# Altium schematic sheet MCU_stm32f407vet6.SchDoc
size 381 x 241 mm; SheetNumber: 1; SheetTotal: 5
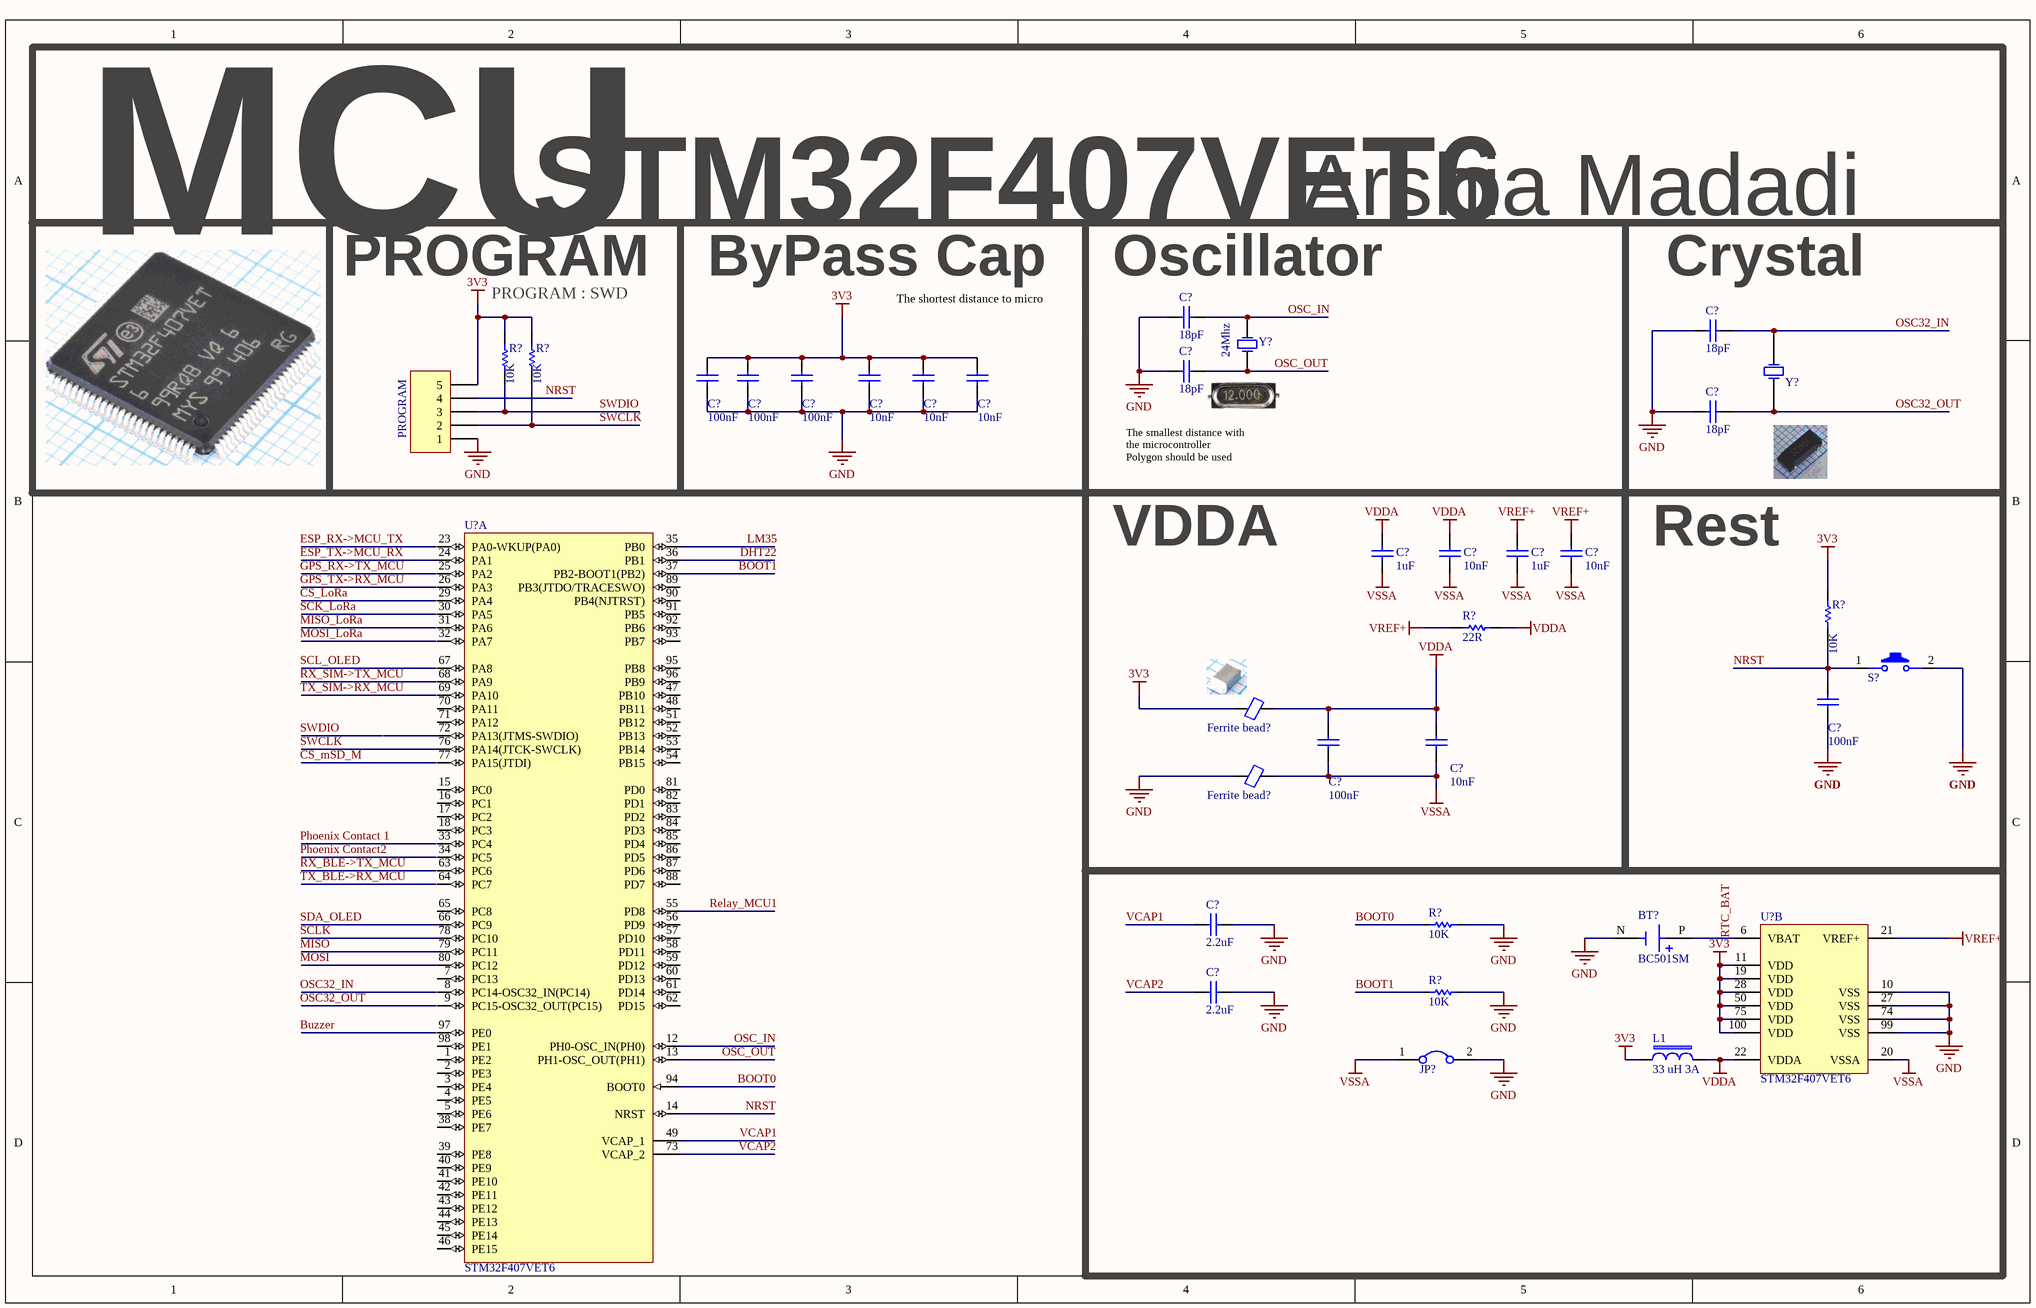
[diagram p0: MCU_stm32f407vet6.SchDoc]

## Parts
(Parts that share a designator on the sheet are numbered #1, #2 ... from top to bottom, then left to right.)
BT?  BC501SM  [BAT_BC501SM]
C?#1  18pF  [MY_CAP_SMD_0603]
C?#2  18pF  [MY_CAP_SMD_0603]
C?#3  18pF  [MY_CAP_SMD_0603]
C?#4  100nF  [MY_CAP_SMD_0603]
C?#5  100nF  [MY_CAP_SMD_0603]
C?#6  100nF  [MY_CAP_SMD_0603]
C?#7  10nF  [MY_CAP_SMD_0603]
C?#8  10nF  [MY_CAP_SMD_0603]
C?#9  10nF  [MY_CAP_SMD_0603]
C?#10  18pF  [MY_CAP_SMD_0603]
C?#11  1uF  [MY_CAP_SMD_0603]
C?#12  10nF  [MY_CAP_SMD_0603]
C?#13  1uF  [MY_CAP_SMD_0603]
C?#14  10nF  [MY_CAP_SMD_0603]
C?#15  100nF  [MY_CAP_SMD_0603]
C?#16  100nF  [MY_CAP_SMD_0603]
C?#17  10nF  [MY_CAP_SMD_0603]
C?#18  2.2uF  [MY_CAP_SMD_0603]
C?#19  2.2uF  [MY_CAP_SMD_0603]
Ferrite_bead?#1  Ferrite Bead SMD  [FB1206]  (value not drawn)
Ferrite_bead?#2  Ferrite Bead SMD  [FB1206]  (value not drawn)
JP?  Jumper  [Jumper Small - 2.54 - GRAY]  (value not drawn)
L1  33 uH 3A  [10UH]
PROGRAM  Header 5  [My_1X05]  (value not drawn)
R?#1  10K  [RESC3413X04N]
R?#2  10K  [RESC3413X04N]
R?#3  10K  [RESC3413X04N]
R?#4  22R  [RESC3413X04N]
R?#5  10K  [0805]
R?#6  10K  [0805]
S?  SW_PB2  [SMD_ALPS_SKQMBBE010]  (value not drawn)
U?#1  STM32F407VET6  [STM-LQFP100_N]  (part A of 2)
U?#2  STM32F407VET6  [STM-LQFP100_N]  (part B of 2)
Y?#1  24Mhz  [Crystal]
Y?#2  11.0592 MHz  [XTAL RTC - V]  (value not drawn)

## Blocks framed on the sheet
MCU: C?#1-C?#10 PROGRAM R?#1 R?#2 Y?#1 Y?#2
VDDA: C?#11-C?#14 C?#16 C?#17 Ferrite_bead?#1 Ferrite_bead?#2 R?#4
Rest: C?#15 R?#3 S?

## Nets
3V3: C?#4.1 C?#5.1 C?#6.1 C?#7.1 C?#8.1 C?#9.1 Ferrite_bead?#1.1 L1.2 PROGRAM.5 R?#1.2 R?#2.2 R?#3.2 U?#2.11(VDD) U?#2.19(VDD) U?#2.28(VDD) U?#2.50(VDD) U?#2.75(VDD) U?#2.100(VDD)
GND: BT?.N(NEG) C?#1.1 C?#2.1 C?#3.1 C?#4.2 C?#5.2 C?#6.2 C?#7.2 C?#8.2 C?#9.2 C?#10.1 C?#15.2 C?#18.2 C?#19.2 Ferrite_bead?#2.1 JP?.2 PROGRAM.1 R?#5.2 R?#6.2 S?.2 U?#2.10(VSS) U?#2.27(VSS) U?#2.74(VSS) U?#2.99(VSS)
VDDA: C?#11.1 C?#12.1 C?#16.1 C?#17.1 Ferrite_bead?#1.2 L1.1 R?#4.2 U?#2.22(VDDA)
VREF+: C?#13.1 C?#14.1 R?#4.1 U?#2.21(VREF+)
VSSA: C?#11.2 C?#12.2 C?#13.2 C?#14.2 C?#16.2 C?#17.2 Ferrite_bead?#2.2 JP?.1 U?#2.20(VSSA)
BOOT0: R?#5.1 U?#1.94(BOOT0)
BOOT1: R?#6.1 U?#1.37(PB2-BOOT1(PB2))
DHT22: U?#1.36(PB1)
LM35: U?#1.35(PB0)
NRST: C?#15.1 PROGRAM.4 R?#3.1 S?.1(Button) U?#1.14(NRST)
OSC32_IN: C?#2.2 Y?#2.2(OSC2)
OSC32_OUT: C?#10.2 Y?#2.1(OSC1)
OSC_IN: C?#1.2 U?#1.12(PH0-OSC_IN(PH0)) Y?#1.2(OSC2)
OSC_OUT: C?#3.2 U?#1.13(PH1-OSC_OUT(PH1)) Y?#1.1(OSC1)
Relay_MCU1: U?#1.55(PD8)
RTC_BAT: BT?.P(POS) U?#2.6(VBAT)
SWCLK: PROGRAM.2 R?#2.1
SWDIO: PROGRAM.3 R?#1.1
VCAP1: C?#18.1 U?#1.49(VCAP_1)
VCAP2: C?#19.1 U?#1.73(VCAP_2)

Not connected (* = marked no-connect by the designer): U?#1 1(PE2) 2(PE3) 3(PE4) 4(PE5) 5(PE6) 7(PC13) 8(PC14-OSC32_IN(PC14)) 9(PC15-OSC32_OUT(PC15)) 15(PC0) 16(PC1) 17(PC2) 18(PC3) 23(PA0-WKUP(PA0)) 24(PA1) 25(PA2) 26(PA3) 29(PA4) 30(PA5) 31(PA6) 32(PA7) 33(PC4) 34(PC5) 38(PE7) 39(PE8) 40(PE9) 41(PE10) 42(PE11) 43(PE12) 44(PE13) 45(PE14) 46(PE15) 47(PB10) 48(PB11) 51(PB12) 52(PB13) 53(PB14) 54(PB15) 56(PD9) 57(PD10) 58(PD11) 59(PD12) 60(PD13) 61(PD14) 62(PD15) 63(PC6) 64(PC7) 65(PC8) 66(PC9) 67(PA8) 68(PA9) 69(PA10) 70(PA11) 71(PA12) 72(PA13(JTMS-SWDIO)) 76(PA14(JTCK-SWCLK)) 77(PA15(JTDI)) 78(PC10) 79(PC11) 80(PC12) 81(PD0) 82(PD1) 83(PD2) 84(PD3) 85(PD4) 86(PD5) 87(PD6) 88(PD7) 89(PB3(JTDO/TRACESWO)) 90(PB4(NJTRST)) 91(PB5) 92(PB6) 93(PB7) 95(PB8) 96(PB9) 97(PE0) 98(PE1)

## Notes on the sheet
- STM32F407VET6
- Arshia Madadi
- PROGRAM
- (near R?#2) PROGRAM : SWD
- ByPass Cap
- (near C?#1) Oscillator
- (near C?#2) Crystal
- (near C?#8) The shortest distance to micro
- The smallest distance with the microcontroller
  Polygon should be used
- Labels drawn without touching a wire or pin: Buzzer, CS_LoRa, CS_mSD_M, ESP_RX->MCU_TX, ESP_TX->MCU_RX, GPS_RX->TX_MCU, GPS_TX->RX_MCU, MISO, MISO_LoRa, MOSI, MOSI_LoRa, OSC32_IN, OSC32_OUT, Phoenix Contact2, Phoenix Contact 1, RX_BLE->TX_MCU, RX_SIM->TX_MCU, SCK_LoRa, SCL_OLED, SCLK, SDA_OLED, SWCLK, SWDIO, TX_BLE->RX_MCU, TX_SIM->RX_MCU

## Library data of the parts
BT? = BC501SM: BATTERY HOLDER COIN 12MM SMD; MF: MPD; SnapEDA_Link: https://www.snapeda.com/parts/BC501SM/MPD/view-part/?ref=snap; Package: None; MP: BC501SM; Price: None; Availability: Unavailable; Check_prices: https://www.snapeda.com/parts/BC501SM/MPD/view-part/?ref=eda; Value: *
C?#1-C?#19 = CAP SMD_0603
Ferrite_bead?#1 Ferrite_bead?#2 = Ferrite Bead SMD Package: Designer: Ali Hafizi
JP? = Jumper: Company: E.P.I.L; Defualt State: Close; Design Date: 2011/11/02
L1 = Inductor_B: Inductor; Code_IEC: 1005; Published: 8-Jun-2000; LatestRevisionDate: 17-Jul-2002; LatestRevisionNote: Re-released for DXP Platform.; PackageReference: 0402-A; Publisher: Altium Limited; Code_JEITA: 0402
PROGRAM = Header 5: Header, 5-Pin; LatestRevisionDate: 17-Jul-2002; LatestRevisionNote: Re-released for DXP Platform.; Publisher: Altium Limited
R?#1-R?#4 = RES 0805 0.125W: RES 0805; Designer: Abbas Basereh; Desc.: RES SMD 0805; Data: 16-12-2016
R?#5 R?#6 = Res: Resistor; Published: 8-Jun-2000; LatestRevisionDate: 17-Jul-2002; LatestRevisionNote: Re-released for DXP Platform.; PackageReference: AXIAL-0.3; Publisher: Altium Limited
S? = SW_PB2: 2 Pin Push Button Switch; Company: SJ Libraries; Designer: Eng. Saeid Jorablo; Mounting Technology: Surface Mount\Through-Hole; ComponentLink1Description: Datasheet; Pin Count: 0; Update Date: 6/3/2012; Category: MISC; HelpURL: http://s3.picofile.com/file/7443264187/Coming_Soon_logo.gif
U?#1 U?#2 = STM32F407VET6: ARM Cortex-M4 32-bit MCU+FPU, 210 DMIPS, 512 kB Flash, 192 kB Internal RAM, 82 I/Os, 100-pin LQFP, -40 to 85 degC, Tray; Manufacturer: STMicroelectronics; D/A Converter: 2x12-bit; FLASH Size (Prog) (kB): 512; I/Os (High Current): 82; Internal RAM Size (kB): 192; Operating Frequency(F) (Processor speed) (MHz): 168; Supply Voltage(Vcc) max (V): 3.6; Supply Voltage(Vcc) min (V): 1.8; DatasheetVersion: Rev. 4; PackageVersion: Rev. 1, 06/2013; PackageReference: LQFP100; PackageDescription: 100-Pin Low Profile Quad Flat Package, 14 x 14 mm Body, 0.5 mm Pitch; Supplier 1: Digi-Key; Supplier Part Number 1: 497-12075-ND; Supplier 2: Farnell; Supplier Part Number 2: 2064367; Supplier 3: Newark; Supplier Part Number 3: 73T2332; Supplier 4: Mouser; Supplier Part Number 4: 511-STM32F407VET6; Core: ARM Cortex-M4; Packing: Tray; Mounting Technology: Surface Mount; PartNumber: STM32F407VET6; ComponentLink1Description: Manufacturer URL; ComponentLink1URL: http://www.st.com/web/en/home.html; ComponentLink2Description: Datasheet; ComponentLink2URL: http://www.st.com/st-web-ui/static/active/en/resource/technical/document/datasheet/DM00037051.pdf; ComponentLink3Description: Package Specification; ComponentLink3URL: http://www.st.com/st-web-ui/static/active/en/resource/technical/document/data_brief/DM00071938.pdf
Y?#1 = XTAL: Crystal Oscillator; Published: 8-Jun-2000; LatestRevisionDate: 17-Jul-2002; LatestRevisionNote: Re-released for DXP Platform.; PackageReference: R38; Publisher: Altium Limited
Y?#2 = XTAL_Crystal: XTAL Crystal; Company: SJ Libraries; Designer: Eng. Saeid Jorablo; Design Date: 11/04/2011; ComponentLink1Description: Datasheet; ComponentLink2Description: Reference; Publisher: SJ Unlimited; Mounting Technology: Surface Mount\Through-Hole; Value: 11.0592 MHz; HelpURL: http://s3.picofile.com/file/7443264187/Coming_Soon_logo.gif; Status: Unreleased